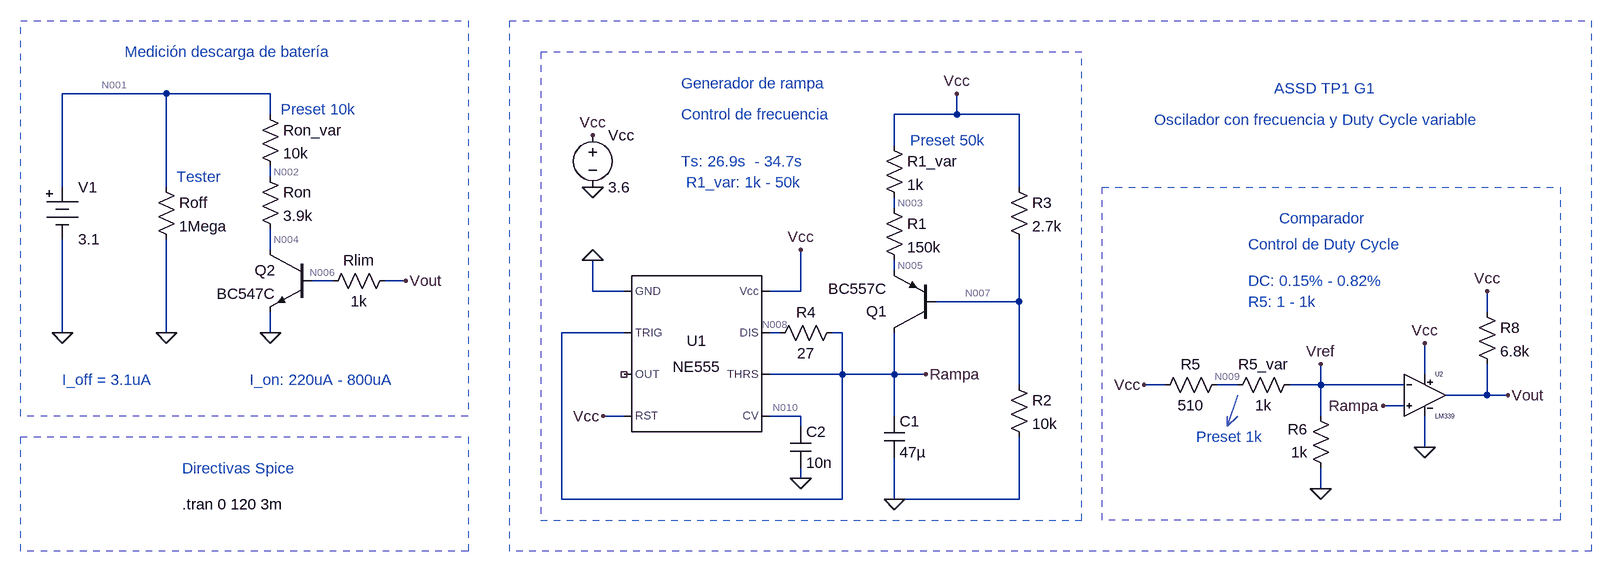
[diagram p0: schematic Test_baterias.asc]
Test_baterias.asc, the LTspice schematic file:
Version 4
SHEET 1 1652 680
WIRE -544 -240 -704 -240
WIRE -384 -240 -544 -240
WIRE -384 -208 -384 -240
WIRE 672 -208 672 -240
WIRE 672 -208 576 -208
WIRE 768 -208 672 -208
WIRE 576 -160 576 -208
WIRE -384 -112 -384 -128
WIRE -704 -96 -704 -240
WIRE -544 -96 -544 -240
WIRE 768 -96 768 -208
WIRE 576 -64 576 -80
WIRE -384 0 -384 -32
WIRE 576 32 576 16
WIRE -288 48 -320 48
WIRE -176 48 -208 48
WIRE 112 64 112 16
WIRE 160 64 112 64
WIRE 432 64 432 0
WIRE 432 64 384 64
WIRE 768 80 768 -16
WIRE 768 80 640 80
WIRE 1488 96 1488 64
WIRE -704 128 -704 -16
WIRE -544 128 -544 -16
WIRE -384 128 -384 96
WIRE 160 128 64 128
WIRE 400 128 384 128
WIRE 496 128 480 128
WIRE 496 192 496 128
WIRE 496 192 384 192
WIRE 576 192 576 128
WIRE 576 192 496 192
WIRE 624 192 576 192
WIRE 1392 192 1392 144
WIRE 768 208 768 80
WIRE 992 208 960 208
WIRE 1104 208 1072 208
WIRE 1232 208 1232 176
WIRE 1232 208 1184 208
WIRE 1360 208 1232 208
WIRE 1488 224 1488 176
WIRE 1488 224 1424 224
WIRE 1520 224 1488 224
WIRE 1360 240 1328 240
WIRE 160 256 128 256
WIRE 432 256 384 256
WIRE 576 256 576 192
WIRE 1232 256 1232 208
WIRE 432 272 432 256
WIRE 1392 304 1392 256
WIRE 432 352 432 336
WIRE 1232 368 1232 336
WIRE 64 384 64 128
WIRE 496 384 496 192
WIRE 496 384 64 384
WIRE 576 384 576 320
WIRE 768 384 768 288
WIRE 768 384 576 384
FLAG 112 -96 0
FLAG 112 -176 Vcc
FLAG 432 0 Vcc
FLAG 112 16 0
FLAG 128 256 Vcc
FLAG 624 192 Rampa
FLAG 576 384 0
FLAG 672 -240 Vcc
FLAG 432 352 0
FLAG 960 208 Vcc
FLAG 1232 368 0
FLAG 1392 144 Vcc
FLAG 1328 240 Rampa
FLAG 1520 224 Vout
FLAG 1232 176 Vref
FLAG 1488 64 Vcc
FLAG 1392 304 0
FLAG -704 128 0
FLAG -544 128 0
FLAG -384 128 0
FLAG -176 48 Vout
SYMBOL Misc\\NE555 272 160 R0
SYMATTR InstName U1
SYMBOL voltage 112 -192 R0
WINDOW 123 0 0 Left 0
WINDOW 39 0 0 Left 0
SYMATTR InstName Vcc
SYMATTR Value 3.6
SYMBOL pnp 640 128 R180
WINDOW 0 75 33 Left 2
WINDOW 3 75 68 Left 2
SYMATTR InstName Q1
SYMATTR Value BC557C
SYMBOL res 752 192 R0
SYMATTR InstName R2
SYMATTR Value 10k
SYMBOL cap 560 256 R0
SYMATTR InstName C1
SYMATTR Value 47µ
SYMBOL res 752 -112 R0
SYMATTR InstName R3
SYMATTR Value 2.7k
SYMBOL cap 416 272 R0
SYMATTR InstName C2
SYMATTR Value 10n
SYMBOL res 496 112 R90
WINDOW 0 0 56 VBottom 2
WINDOW 3 32 56 VTop 2
SYMATTR InstName R4
SYMATTR Value 27
SYMBOL res 1088 192 R90
WINDOW 0 0 56 VBottom 2
WINDOW 3 32 56 VTop 2
SYMATTR InstName R5
SYMATTR Value 510
SYMBOL res 1248 352 R180
WINDOW 0 36 76 Left 2
WINDOW 3 36 40 Left 2
SYMATTR InstName R6
SYMATTR Value 1k
SYMBOL res 1472 80 R0
SYMATTR InstName R8
SYMATTR Value 6.8k
SYMBOL res 1200 192 R90
WINDOW 0 0 56 VBottom 2
WINDOW 3 32 56 VTop 2
SYMATTR InstName R5_var
SYMATTR Value 1k
SYMBOL res -560 -112 R0
SYMATTR InstName Roff
SYMATTR Value 1Mega
SYMBOL res -400 -128 R0
SYMATTR InstName Ron
SYMATTR Value 3.9k
SYMBOL npn -320 0 M0
SYMATTR InstName Q2
SYMATTR Value BC547C
SYMBOL res -192 32 R90
WINDOW 0 0 56 VBottom 2
WINDOW 3 32 56 VTop 2
SYMATTR InstName Rlim
SYMATTR Value 1k
SYMBOL LM339 1392 160 R0
SYMATTR InstName U2
SYMBOL res 560 -80 R0
SYMATTR InstName R1
SYMATTR Value 150k
SYMBOL res 560 -176 R0
SYMATTR InstName R1_var
SYMATTR Value 1k
SYMBOL res -400 -224 R0
SYMATTR InstName Ron_var
SYMATTR Value 10k
SYMBOL Misc\\battery -704 -112 R0
WINDOW 123 0 0 Left 0
WINDOW 39 0 0 Left 0
SYMATTR InstName V1
SYMATTR Value 3.1
TEXT -520 392 Left 2 !.tran 0 120 3m
TEXT 600 -168 Left 2 ;Preset 50k
TEXT 1160 -248 Left 2 ;ASSD TP1 G1
TEXT 976 -200 Left 2 ;Oscilador con frecuencia y Duty Cycle variable
TEXT 1040 288 Left 2 ;Preset 1k
TEXT 248 -256 Left 2 ;Generador de rampa
TEXT 1168 -48 Left 2 ;Comparador
TEXT 248 -208 Left 2 ;Control de frecuencia
TEXT 1120 -8 Left 2 ;Control de Duty Cycle
TEXT -368 -216 Left 2 ;Preset 10k
TEXT -608 -304 Left 2 ;Medición descarga de batería
TEXT -520 336 Left 2 ;Directivas Spice
TEXT -528 -112 Left 2 ;Tester
TEXT -704 200 Left 2 ;I_off = 3.1uA
TEXT -416 200 Left 2 ;I_on: 220uA - 800uA
TEXT 248 -136 Left 2 ;Ts: 26.9s  - 34.7s
TEXT 1120 48 Left 2 ;DC: 0.15% - 0.82%
TEXT 1120 80 Left 2 ;R5: 1 - 1k
TEXT 256 -104 Left 2 ;R1_var: 1k - 50k
LINE Normal 1088 272 1104 224
LINE Normal 1088 256 1088 272
LINE Normal 1088 272 1088 256
LINE Normal 1104 256 1088 272
RECTANGLE Normal 864 -304 32 416 3
RECTANGLE Normal 1600 416 896 -96 3
RECTANGLE Normal 1648 464 -16 -352 2
RECTANGLE Normal -80 256 -768 -352 2
RECTANGLE Normal -80 464 -768 288 2

The netlist it stands for:
* Test_baterias.asc
XU1 0 Rampa NC_01 Vcc N010 Rampa N008 Vcc NE555  ; pins GND TRIG OUT RST CV THRS DIS Vcc
Vcc Vcc 0 3.6
Q1 Rampa N007 N005 0 BC557C
R2 N007 0 10k
C1 Rampa 0 47µ
R3 Vcc N007 2.7k
C2 N010 0 10n
R4 Rampa N008 27
R5 N009 Vcc 510
R6 0 Vref 1k
R8 Vcc Vout 6.8k
R5_var Vref N009 1k
Roff N001 0 1Mega
Ron N002 N004 3.9k
Q2 N004 N006 0 0 BC547C
Rlim Vout N006 1k
XU2 Rampa Vref Vcc 0 Vout LM339  ; pins In+ In- V+ V- OUT
R1 N003 N005 150k
R1_var Vcc N003 1k
Ron_var N001 N002 10k
V1 N001 0 3.1
.model NPN NPN
.model PNP PNP
.lib standard.bjt
.tran 0 120 3m
* Preset 50k
* ASSD TP1 G1
* Oscilador con frecuencia y Duty Cycle variable
* Preset 1k
* Generador de rampa
* Comparador
* Control de frecuencia
* Control de Duty Cycle
* Preset 10k
* Medición descarga de batería
* Directivas Spice
* Tester
* I_off = 3.1uA
* I_on: 220uA - 800uA
* Ts: 26.9s  - 34.7s
* DC: 0.15% - 0.82%
* R5: 1 - 1k
* R1_var: 1k - 50k
.lib NE555.sub
.lib LM339.sub
.backanno
.end

* Results of the author's LTspice run, read from the files saved beside the schematic
* Operating Point, zero values left out:
*   V(rampa) = 3.347 V
*   V(n010) = 2.4 V
*   V(vcc) = 3.6 V
*   V(n008) = 3.347 V
*   V(n007) = 2.838 V
*   V(n005) = 3.351 V
*   V(n009) = 2.869 V
*   V(vref) = 1.434 V
*   V(vout) = 1.035 V
*   V(n001) = 3.1 V
*   V(n002) = 869.1 mV
*   V(n004) = -968.5 µV
*   V(n006) = 658.3 mV
*   V(n003) = 3.598 V
*   Ic(Q1) = -11.17 nA
*   Ib(Q1) = -1.637 µA
*   Ie(Q1) = 1.648 µA
*   Ic(Q2) = 223.1 µA
*   Ib(Q2) = 377.1 µA
*   Ie(Q2) = -600.2 µA
*   I(R2) = 283.8 µA
*   I(R3) = 282.2 µA
*   I(R4) = 4.466 nA
*   I(R5) = -1.434 mA
*   I(R6) = -1.434 mA
*   I(R8) = 377.1 µA
*   I(R5_var) = -1.434 mA
*   I(Roff) = 3.1 µA
*   I(Ron) = 223.1 µA
*   I(Rlim) = 377.1 µA
*   I(R1) = 1.648 µA
*   I(R1_var) = 1.648 µA
*   I(Ron_var) = 223.1 µA
*   I(Vcc) = -3.43 mA
*   I(V1) = -226.2 µA
*   Ix(u1:1) = -1.157 mA
*   Ix(u1:2) = 3.347 nA
*   Ix(u1:4) = 13.33 µA
*   Ix(u1:6) = 3.347 nA
*   Ix(u1:7) = 4.466 nA
*   Ix(u1:8) = 1.144 mA
*   Ix(u2:1) = 5.332 pA
*   Ix(u2:2) = -49.97 nA
*   Ix(u2:3) = 177.8 µA
*   Ix(u2:4) = -177.7 µA
*   Ix(u2:5) = 1.02 pA
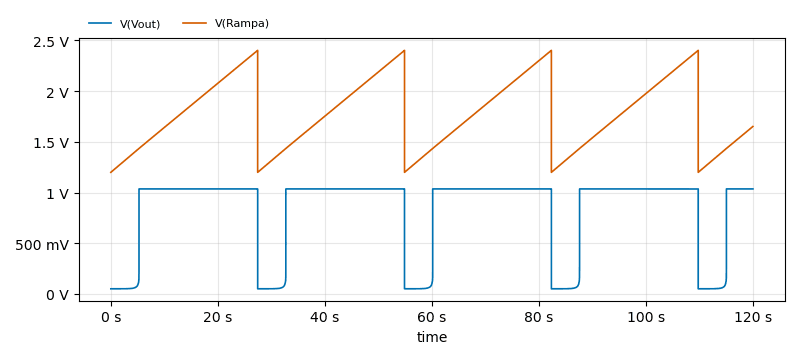
[diagram p1: Transient Analysis of Test_baterias.asc, plotted from the saved traces]
* Transient Analysis, 1 run:
*   V(Vout): min 51.15 mV, max 1.036 V, average 820.7 mV, rms 915.2 mV, last 1.035 V
*   V(Rampa): min 1.199 V, max 2.401 V, average 1.771 V, rms 1.826 V, last 1.651 V